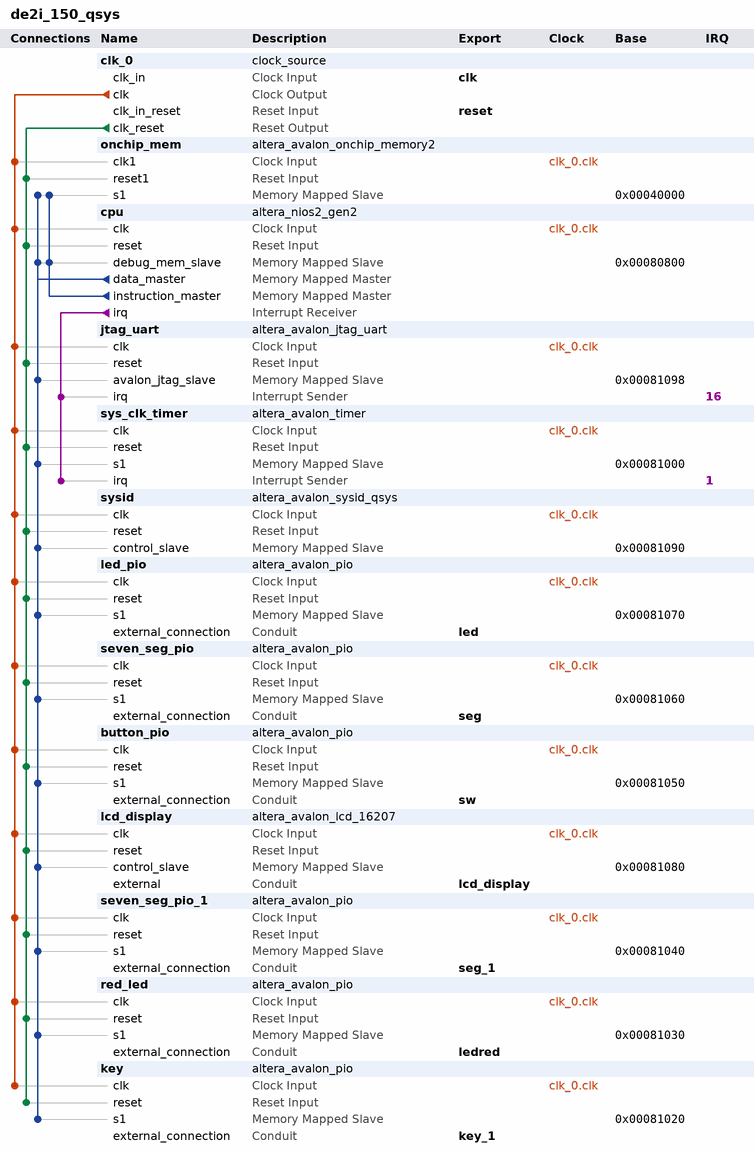
[diagram p0: system contents]
# Platform Designer (Qsys) system de2i_150_qsys, Cyclone IV GX EP4CGX150DF31C7
# Parameters at their usual value, and those the tool derives, are not listed.
package require -exact qsys 18.0
create_system de2i_150_qsys
set_project_property DEVICE_FAMILY {Cyclone IV GX}
set_project_property DEVICE EP4CGX150DF31C7

add_instance clk_0 clock_source 18.0
set_instance_parameter_value clk_0 clockFrequency 50000000

add_instance onchip_mem altera_avalon_onchip_memory2 18.0
set_instance_parameter_value onchip_mem dataWidth 32
set_instance_parameter_value onchip_mem dualPort false
set_instance_parameter_value onchip_mem initMemContent true
set_instance_parameter_value onchip_mem initializationFileName onchip_mem.hex
set_instance_parameter_value onchip_mem memorySize 200480

add_instance cpu altera_nios2_gen2 18.0
set_instance_parameter_value cpu dcache_size 0
set_instance_parameter_value cpu exceptionSlave onchip_mem.s1
set_instance_parameter_value cpu icache_size 2048
set_instance_parameter_value cpu impl Fast
set_instance_parameter_value cpu resetSlave onchip_mem.s1
set_instance_parameter_value cpu setting_branchpredictiontype Static

add_instance jtag_uart altera_avalon_jtag_uart 18.0
set_instance_parameter_value jtag_uart simInteractiveOptions NO_INTERACTIVE_WINDOWS

add_instance sys_clk_timer altera_avalon_timer 18.0
set_instance_parameter_value sys_clk_timer period 1
set_instance_parameter_value sys_clk_timer periodUnits MSEC

add_instance sysid altera_avalon_sysid_qsys 18.0
set_instance_parameter_value sysid id 0

add_instance led_pio altera_avalon_pio 18.0
set_instance_parameter_value led_pio direction Output
set_instance_parameter_value led_pio width 8

add_instance seven_seg_pio altera_avalon_pio 18.0
set_instance_parameter_value seven_seg_pio direction Output
set_instance_parameter_value seven_seg_pio width 28

add_instance button_pio altera_avalon_pio 18.0
set_instance_parameter_value button_pio direction Input
set_instance_parameter_value button_pio width 18

add_instance lcd_display altera_avalon_lcd_16207 18.0

add_instance seven_seg_pio_1 altera_avalon_pio 18.0
set_instance_parameter_value seven_seg_pio_1 direction Output
set_instance_parameter_value seven_seg_pio_1 width 28

add_instance red_led altera_avalon_pio 18.0
set_instance_parameter_value red_led direction Output
set_instance_parameter_value red_led width 18

add_instance key altera_avalon_pio 18.0
set_instance_parameter_value key direction Input
set_instance_parameter_value key width 4

# connections
add_connection clk_0.clk button_pio.clk clock
add_connection clk_0.clk cpu.clk clock
add_connection clk_0.clk jtag_uart.clk clock
add_connection clk_0.clk key.clk clock
add_connection clk_0.clk lcd_display.clk clock
add_connection clk_0.clk led_pio.clk clock
add_connection clk_0.clk onchip_mem.clk1 clock
add_connection clk_0.clk red_led.clk clock
add_connection clk_0.clk seven_seg_pio.clk clock
add_connection clk_0.clk seven_seg_pio_1.clk clock
add_connection clk_0.clk sys_clk_timer.clk clock
add_connection clk_0.clk sysid.clk clock
add_connection clk_0.clk_reset button_pio.reset reset
add_connection clk_0.clk_reset cpu.reset reset
add_connection clk_0.clk_reset jtag_uart.reset reset
add_connection clk_0.clk_reset key.reset reset
add_connection clk_0.clk_reset lcd_display.reset reset
add_connection clk_0.clk_reset led_pio.reset reset
add_connection clk_0.clk_reset onchip_mem.reset1 reset
add_connection clk_0.clk_reset red_led.reset reset
add_connection clk_0.clk_reset seven_seg_pio.reset reset
add_connection clk_0.clk_reset seven_seg_pio_1.reset reset
add_connection clk_0.clk_reset sys_clk_timer.reset reset
add_connection clk_0.clk_reset sysid.reset reset
add_connection cpu.data_master button_pio.s1 avalon
set_connection_parameter_value cpu.data_master/button_pio.s1 baseAddress 0x00081050
add_connection cpu.data_master cpu.debug_mem_slave avalon
set_connection_parameter_value cpu.data_master/cpu.debug_mem_slave baseAddress 0x00080800
add_connection cpu.data_master jtag_uart.avalon_jtag_slave avalon
set_connection_parameter_value cpu.data_master/jtag_uart.avalon_jtag_slave baseAddress 0x00081098
add_connection cpu.data_master key.s1 avalon
set_connection_parameter_value cpu.data_master/key.s1 baseAddress 0x00081020
add_connection cpu.data_master lcd_display.control_slave avalon
set_connection_parameter_value cpu.data_master/lcd_display.control_slave baseAddress 0x00081080
add_connection cpu.data_master led_pio.s1 avalon
set_connection_parameter_value cpu.data_master/led_pio.s1 baseAddress 0x00081070
add_connection cpu.data_master onchip_mem.s1 avalon
set_connection_parameter_value cpu.data_master/onchip_mem.s1 baseAddress 0x00040000
add_connection cpu.data_master red_led.s1 avalon
set_connection_parameter_value cpu.data_master/red_led.s1 baseAddress 0x00081030
add_connection cpu.data_master seven_seg_pio.s1 avalon
set_connection_parameter_value cpu.data_master/seven_seg_pio.s1 baseAddress 0x00081060
add_connection cpu.data_master seven_seg_pio_1.s1 avalon
set_connection_parameter_value cpu.data_master/seven_seg_pio_1.s1 baseAddress 0x00081040
add_connection cpu.data_master sys_clk_timer.s1 avalon
set_connection_parameter_value cpu.data_master/sys_clk_timer.s1 baseAddress 0x00081000
add_connection cpu.data_master sysid.control_slave avalon
set_connection_parameter_value cpu.data_master/sysid.control_slave baseAddress 0x00081090
add_connection cpu.instruction_master cpu.debug_mem_slave avalon
set_connection_parameter_value cpu.instruction_master/cpu.debug_mem_slave baseAddress 0x00080800
add_connection cpu.instruction_master onchip_mem.s1 avalon
set_connection_parameter_value cpu.instruction_master/onchip_mem.s1 baseAddress 0x00040000
add_connection cpu.irq jtag_uart.irq interrupt
set_connection_parameter_value cpu.irq/jtag_uart.irq irqNumber 16
add_connection cpu.irq sys_clk_timer.irq interrupt
set_connection_parameter_value cpu.irq/sys_clk_timer.irq irqNumber 1

# exported interfaces
add_interface clk clock sink
set_interface_property clk EXPORT_OF clk_0.clk_in
add_interface key_1 conduit end
set_interface_property key_1 EXPORT_OF key.external_connection
add_interface lcd_display conduit end
set_interface_property lcd_display EXPORT_OF lcd_display.external
add_interface led conduit end
set_interface_property led EXPORT_OF led_pio.external_connection
add_interface ledred conduit end
set_interface_property ledred EXPORT_OF red_led.external_connection
add_interface reset reset sink
set_interface_property reset EXPORT_OF clk_0.clk_in_reset
add_interface seg conduit end
set_interface_property seg EXPORT_OF seven_seg_pio.external_connection
add_interface seg_1 conduit end
set_interface_property seg_1 EXPORT_OF seven_seg_pio_1.external_connection
add_interface sw conduit end
set_interface_property sw EXPORT_OF button_pio.external_connection

set_interconnect_requirement {$system} qsys_mm.clockCrossingAdapter HANDSHAKE
set_interconnect_requirement {$system} qsys_mm.enableEccProtection FALSE
set_interconnect_requirement {$system} qsys_mm.insertDefaultSlave FALSE
set_interconnect_requirement {$system} qsys_mm.maxAdditionalLatency 1

save_system de2i_150_qsys.qsys
